# EAGLE design Brakelight2019 (EAGLE 9.1.3)
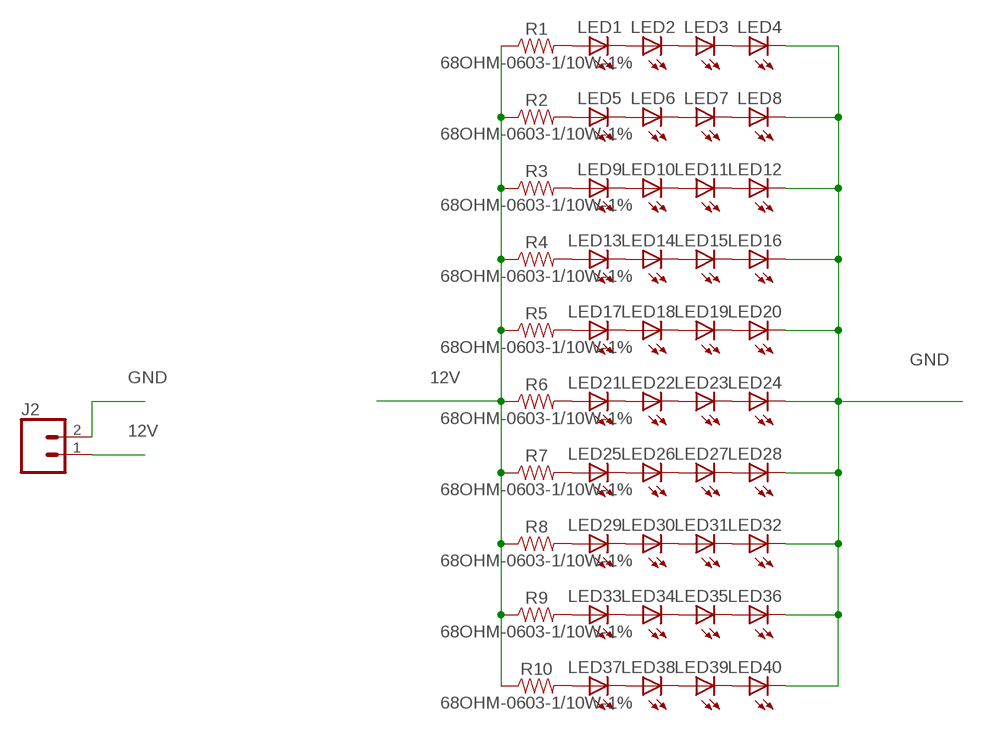
[diagram p0: schematic, sheet 1]

## Parts
J2  CONN_02POLAR  [MOLEX-1X2]
LED1  LED5MM  [LED5MM]
LED2  LED5MM  [LED5MM]
LED3  LED5MM  [LED5MM]
LED4  LED5MM  [LED5MM]
LED5  LED5MM  [LED5MM]
LED6  LED5MM  [LED5MM]
LED7  LED5MM  [LED5MM]
LED8  LED5MM  [LED5MM]
LED9  LED5MM  [LED5MM]
LED10  LED5MM  [LED5MM]
LED11  LED5MM  [LED5MM]
LED12  LED5MM  [LED5MM]
LED13  LED5MM  [LED5MM]
LED14  LED5MM  [LED5MM]
LED15  LED5MM  [LED5MM]
LED16  LED5MM  [LED5MM]
LED17  LED5MM  [LED5MM]
LED18  LED5MM  [LED5MM]
LED19  LED5MM  [LED5MM]
LED20  LED5MM  [LED5MM]
LED21  LED5MM  [LED5MM]
LED22  LED5MM  [LED5MM]
LED23  LED5MM  [LED5MM]
LED24  LED5MM  [LED5MM]
LED25  LED5MM  [LED5MM]
LED26  LED5MM  [LED5MM]
LED27  LED5MM  [LED5MM]
LED28  LED5MM  [LED5MM]
LED29  LED5MM  [LED5MM]
LED30  LED5MM  [LED5MM]
LED31  LED5MM  [LED5MM]
LED32  LED5MM  [LED5MM]
LED33  LED5MM  [LED5MM]
LED34  LED5MM  [LED5MM]
LED35  LED5MM  [LED5MM]
LED36  LED5MM  [LED5MM]
LED37  LED5MM  [LED5MM]
LED38  LED5MM  [LED5MM]
LED39  LED5MM  [LED5MM]
LED40  LED5MM  [LED5MM]
R1  68OHM-0603-1/10W-1%  [0603]
R2  68OHM-0603-1/10W-1%  [0603]
R3  68OHM-0603-1/10W-1%  [0603]
R4  68OHM-0603-1/10W-1%  [0603]
R5  68OHM-0603-1/10W-1%  [0603]
R6  68OHM-0603-1/10W-1%  [0603]
R7  68OHM-0603-1/10W-1%  [0603]
R8  68OHM-0603-1/10W-1%  [0603]
R9  68OHM-0603-1/10W-1%  [0603]
R10  68OHM-0603-1/10W-1%  [0603]

## Nets
12V: J2.1 R1.1 R2.1 R3.1 R4.1 R5.1 R6.1 R7.1 R8.1 R9.1 R10.1
GND: J2.2 LED4.K(C) LED8.K(C) LED12.K(C) LED16.K(C) LED20.K(C) LED24.K(C) LED28.K(C) LED32.K(C) LED36.K(C) LED40.K(C)
N$1: LED1.A R1.2
N$2: LED1.K(C) LED2.A
N$3: LED2.K(C) LED3.A
N$4: LED3.K(C) LED4.A
N$5: LED5.A R2.2
N$6: LED5.K(C) LED6.A
N$7: LED6.K(C) LED7.A
N$8: LED7.K(C) LED8.A
N$9: LED9.A R3.2
N$10: LED9.K(C) LED10.A
N$11: LED10.K(C) LED11.A
N$12: LED11.K(C) LED12.A
N$13: LED13.A R4.2
N$14: LED13.K(C) LED14.A
N$15: LED14.K(C) LED15.A
N$16: LED15.K(C) LED16.A
N$17: LED17.A R5.2
N$18: LED17.K(C) LED18.A
N$19: LED18.K(C) LED19.A
N$20: LED19.K(C) LED20.A
N$21: LED21.A R6.2
N$22: LED21.K(C) LED22.A
N$23: LED22.K(C) LED23.A
N$24: LED23.K(C) LED24.A
N$25: LED25.A R7.2
N$26: LED25.K(C) LED26.A
N$27: LED26.K(C) LED27.A
N$28: LED27.K(C) LED28.A
N$29: LED29.A R8.2
N$30: LED29.K(C) LED30.A
N$31: LED30.K(C) LED31.A
N$32: LED31.K(C) LED32.A
N$33: LED33.A R9.2
N$34: LED33.K(C) LED34.A
N$35: LED34.K(C) LED35.A
N$36: LED35.K(C) LED36.A
N$37: LED37.A R10.2
N$38: LED37.K(C) LED38.A
N$39: LED38.K(C) LED39.A
N$40: LED39.K(C) LED40.A

## Library data of the parts
J2 = SparkFun-Connectors:CONN_02: Multi connection point. Often used as Generic Header-pin footprint for 0.1 inch spaced/style header connections On any of the 0.1 inch spaced packages, you can populate with these: Break Away Headers - Straight <https://www.sparkfun.com/products/116> (PRT-00116) Break Away Male Headers - Right Angle <https://www.sparkfun.com/products/553> (PRT-00553) Female Headers <https://www.sparkfun.com/products/115> (PRT-00115) Break Away Headers - Machine Pin <https://www.sparkfun.com/products/117> (PRT-00117) Break Away Female Headers - Swiss Machine Pin <https://www.sparkfun.com/products/743> (PRT-00743) For SCREWTERMINALS and SPRING TERMINALS visit here: Screw Terimnals on SparkFun.com <https://www.sparkfun.com/search/results?term=Screw+Terminals> (5mm/3.5mm/2.54mm spacing) This device is also useful as a general connection point to wire up your design to another part of your project. Our various solder wires solder well into these plated through hole pads. Hook-Up Wire - Assortment (Stranded, 22 AWG) <https://www.sparkfun.com/products/11375> (PRT-11375) Hook-Up Wire - Assortment (Solid Core, 22 AWG) <https://www.sparkfun.com/products/11367> (PRT-11367) View the entire wire category on our website here <https://www.sparkfun.com/categories/141> Special notes: Molex polarized connector foot print use with: PRT-08233 with associated crimp pins and housings. 2.54_SCREWTERM for use with PRT-10571. 3.5mm Screw Terminal footprints for PRT-08084 5mm Screw Terminal footprints for use with PRT-08432; SF_ID: PRT-09918
LED1-LED40 = adafruit:LED: LED OSRAM: - CHIPLED LG R971, LG N971, LY N971, LG Q971, LY Q971, LO R971, LY R971 LH N974, LH R974 LS Q976, LO Q976, LY Q976 LO Q996 - Hyper CHIPLED LW Q18S LB Q993, LB Q99A, LB R99A - SideLED LS A670, LO A670, LY A670, LG A670, LP A670 LB A673, LV A673, LT A673, LW A673 LH A674 LY A675 LS A676, LA A676, LO A676, LY A676, LW A676 LS A679, LY A679, LG A679 - Hyper Micro SIDELED® LS Y876, LA Y876, LO Y876, LY Y876 LT Y87S - SmartLED LW L88C, LW L88S LB L89C, LB L89S, LG L890 LS L89K, LO L89K, LY L89K LS L896, LA L896, LO L896, LY L896 - TOPLED LS T670, LO T670, LY T670, LG T670, LP T670 LSG T670, LSP T670, LSY T670, LOP T670, LYG T670 LG T671, LOG T671, LSG T671 LB T673, LV T673, LT T673, LW T673 LH T674 LS T676, LA T676, LO T676, LY T676, LB T676, LH T676, LSB T676, LW T676 LB T67C, LV T67C, LT T67C, LS T67K, LO T67K, LY T67K, LW E67C LS E67B, LA E67B, LO E67B, LY E67B, LB E67C, LV E67C, LT E67C LW T67C LS T679, LY T679, LG T679 LS T770, LO T770, LY T770, LG T770, LP T770 LB T773, LV T773, LT T773, LW T773 LH T774 LS E675, LA E675, LY E675, LS T675 LS T776, LA T776, LO T776, LY T776, LB T776 LHGB T686 LT T68C, LB T68C - Hyper Mini TOPLED® LB M676 - Mini TOPLED Santana® LG M470 LS M47K, LO M47K, LY M47K Source: http://www.osram.convergy.de/
R1-R10 = SparkFun-Resistors:68OHM: 68Ω resistor A resistor is a passive two-terminal electrical component that implements electrical resistance as a circuit element. Resistors act to reduce current flow, and, at the same time, act to lower voltage levels within circuits. - Wikipedia

## Board
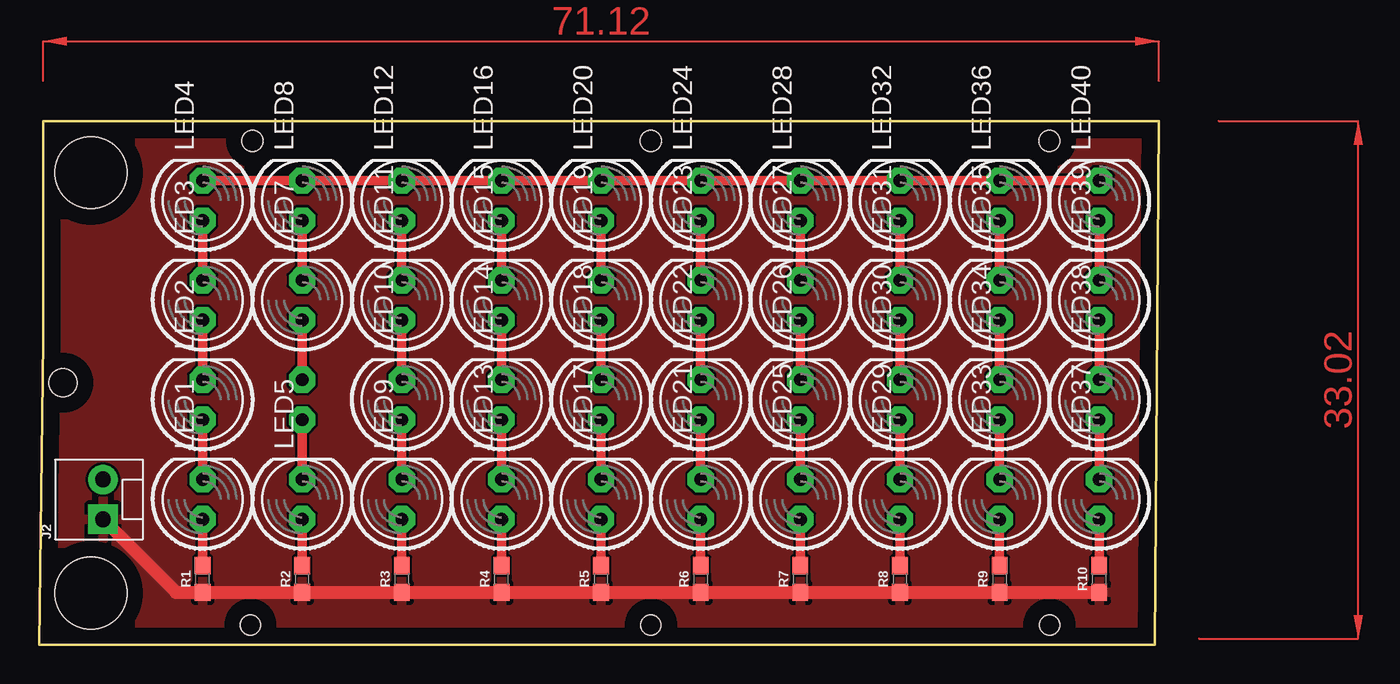
[diagram p1: board, top side]
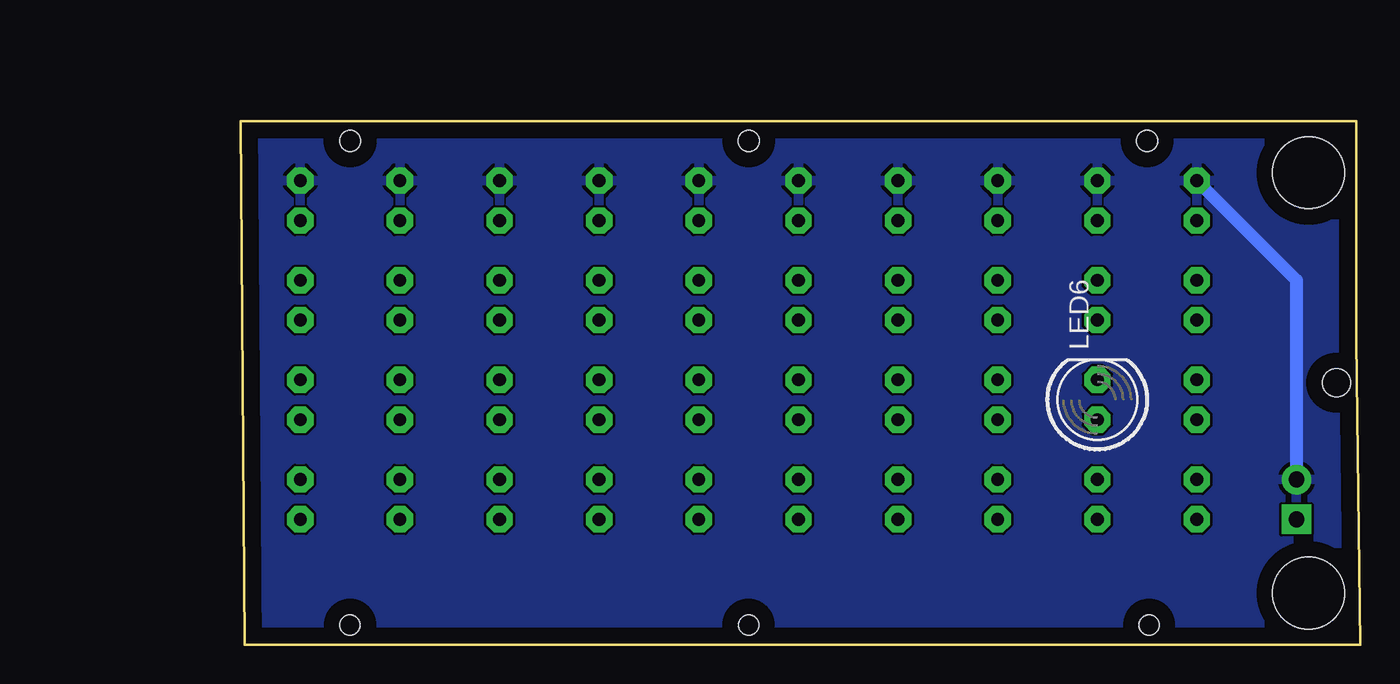
[diagram p2: board, bottom side, seen from below]

Size 71.37 x 33.4 mm. Coordinates in mm from the lower left corner, seen from the top.
Outline: 0,0 71.12,0 71.37,33.4 0.25,33.4 0.25,19.43 0,0
Copper layers (1*16): Top 0.035mm / dielectric 1.5mm / Bottom 0.035mm
Design rules "default": minimum track width 6mil, minimum drill 0.35mm, track to track 6mil, track to pad 6mil, pad to pad 6mil, via to via 6mil, smd to smd 6mil, copper to edge 40mil, drill to drill 6mil, minimum pad ring 10mil, minimum via ring 8mil, stop-mask expansion 4mil, vias tented up to drill 0mil, thermal gap 10mil
Holes 4.57 mm at 3.3,3.3 3.3,30.1
Holes 1.78 mm at 1.52,16.71
Holes 1.32 mm at 13.59,32.13 38.99,32.13 64.39,32.13
Holes 1.27 mm at 64.39,1.27 38.99,1.27 13.46,1.27

### Footprints (pad centres in the part's own frame; a part is rotated, then mirrored left to right if it is on the bottom)
MOLEX-1X2 = drill 1.016 pad 1.88 square: 1 0,0 | drill 1.016 pad 1.88: 2 2.54,0
LED5MM = drill 0.813 pad 1.676 octagon: A -1.27,0; K 1.27,0
0603 = smd 1.1 x 1: 1 -0.85,0; 2 0.85,0

### Placement (x,y rotation side)
J2  4.06,8 90 top
LED1  10.41,9.27 90 top
LED2  10.41,15.62 90 top
LED3  10.41,21.97 90 top
LED4  10.41,28.32 90 top
LED5  16.76,9.27 90 top
LED6  16.76,15.62 90 bottom
LED7  16.76,21.97 90 top
LED8  16.76,28.32 90 top
LED9  23.11,9.27 90 top
LED10  23.11,15.62 90 top
LED11  23.11,21.97 90 top
LED12  23.11,28.32 90 top
LED13  29.46,9.27 90 top
LED14  29.46,15.62 90 top
LED15  29.46,21.97 90 top
LED16  29.46,28.32 90 top
LED17  35.81,9.27 90 top
LED18  35.81,15.62 90 top
LED19  35.81,21.97 90 top
LED20  35.81,28.32 90 top
LED21  42.16,9.27 90 top
LED22  42.16,15.62 90 top
LED23  42.16,21.97 90 top
LED24  42.16,28.32 90 top
LED25  48.51,9.27 90 top
LED26  48.51,15.62 90 top
LED27  48.51,21.97 90 top
LED28  48.51,28.32 90 top
LED29  54.86,9.27 90 top
LED30  54.86,15.62 90 top
LED31  54.86,21.97 90 top
LED32  54.86,28.32 90 top
LED33  61.21,9.27 90 top
LED34  61.21,15.62 90 top
LED35  61.21,21.97 90 top
LED36  61.21,28.32 90 top
LED37  67.56,9.27 90 top
LED38  67.56,15.62 90 top
LED39  67.56,21.97 90 top
LED40  67.56,28.32 90 top
R1  10.41,4.19 90 top
R2  16.76,4.19 90 top
R3  23.11,4.19 90 top
R4  29.46,4.19 90 top
R5  35.81,4.19 90 top
R6  42.16,4.19 90 top
R7  48.51,4.19 90 top
R8  54.86,4.19 90 top
R9  61.21,4.19 90 top
R10  67.56,4.19 90 top

### Tracks (layer width: path | path; a pad name or v marks a point on that pad's centre or on a via)
12V
  Top 0.813: J2.1 8.72,3.34 R1.1 R2.1 R3.1 R4.1 R5.1 R6.1 R7.1 R8.1 R9.1 R10.1
  pour Top: 0,33.4 71.12,33.4 71.12,0 0,0
GND
  Top 0.61: LED40.K LED36.K LED32.K LED28.K LED24.K LED20.K LED16.K LED12.K LED8.K LED4.K
  Bottom 0.813: LED4.K 4.06,23.24 J2.2
  pour Bottom: 0,33.4 71.12,33.4 71.12,0 0,0
N$1
  Top 0.61: R1.2 LED1.A
N$2
  Top 0.61: LED1.K LED2.A
N$3
  Top 0.61: LED2.K LED3.A
N$4
  Top 0.61: LED3.K LED4.A
N$5
  Top 0.61: R2.2 LED5.A
N$6
  Top 0.61: LED5.K LED6.A
N$7
  Top 0.61: LED6.K LED7.A
N$8
  Top 0.61: LED7.K LED8.A
N$9
  Top 0.61: R3.2 LED9.A
N$10
  Top 0.61: LED9.K LED10.A
N$11
  Top 0.61: LED10.K LED11.A
N$12
  Top 0.61: LED11.K LED12.A
N$13
  Top 0.61: R4.2 LED13.A
N$14
  Top 0.61: LED13.K LED14.A
N$15
  Top 0.61: LED14.K LED15.A
N$16
  Top 0.61: LED15.K LED16.A
N$17
  Top 0.61: R5.2 LED17.A
N$18
  Top 0.61: LED17.K LED18.A
N$19
  Top 0.61: LED18.K LED19.A
N$20
  Top 0.61: LED19.K LED20.A
N$21
  Top 0.61: R6.2 LED21.A
N$22
  Top 0.61: LED21.K LED22.A
N$23
  Top 0.61: LED22.K LED23.A
N$24
  Top 0.61: LED23.K LED24.A
N$25
  Top 0.61: R7.2 LED25.A
N$26
  Top 0.61: LED25.K LED26.A
N$27
  Top 0.61: LED26.K LED27.A
N$28
  Top 0.61: LED27.K LED28.A
N$29
  Top 0.61: R8.2 LED29.A
N$30
  Top 0.61: LED29.K LED30.A
N$31
  Top 0.61: LED30.K LED31.A
N$32
  Top 0.61: LED31.K LED32.A
N$33
  Top 0.61: R9.2 LED33.A
N$34
  Top 0.61: LED33.K LED34.A
N$35
  Top 0.61: LED34.K LED35.A
N$36
  Top 0.61: LED35.K LED36.A
N$37
  Top 0.61: R10.2 LED37.A
N$38
  Top 0.61: LED37.K LED38.A
N$39
  Top 0.61: LED38.K LED39.A
N$40
  Top 0.61: LED39.K LED40.A
(copper drawn outside any net)
  shapes: Top area x2